# EAGLE design piezopiano (EAGLE 9.6.2)
CHECKED_BY: -; DRAWN_BY: Andreas Zapfl; REV: 1.4; TITLE: PiezoPiano
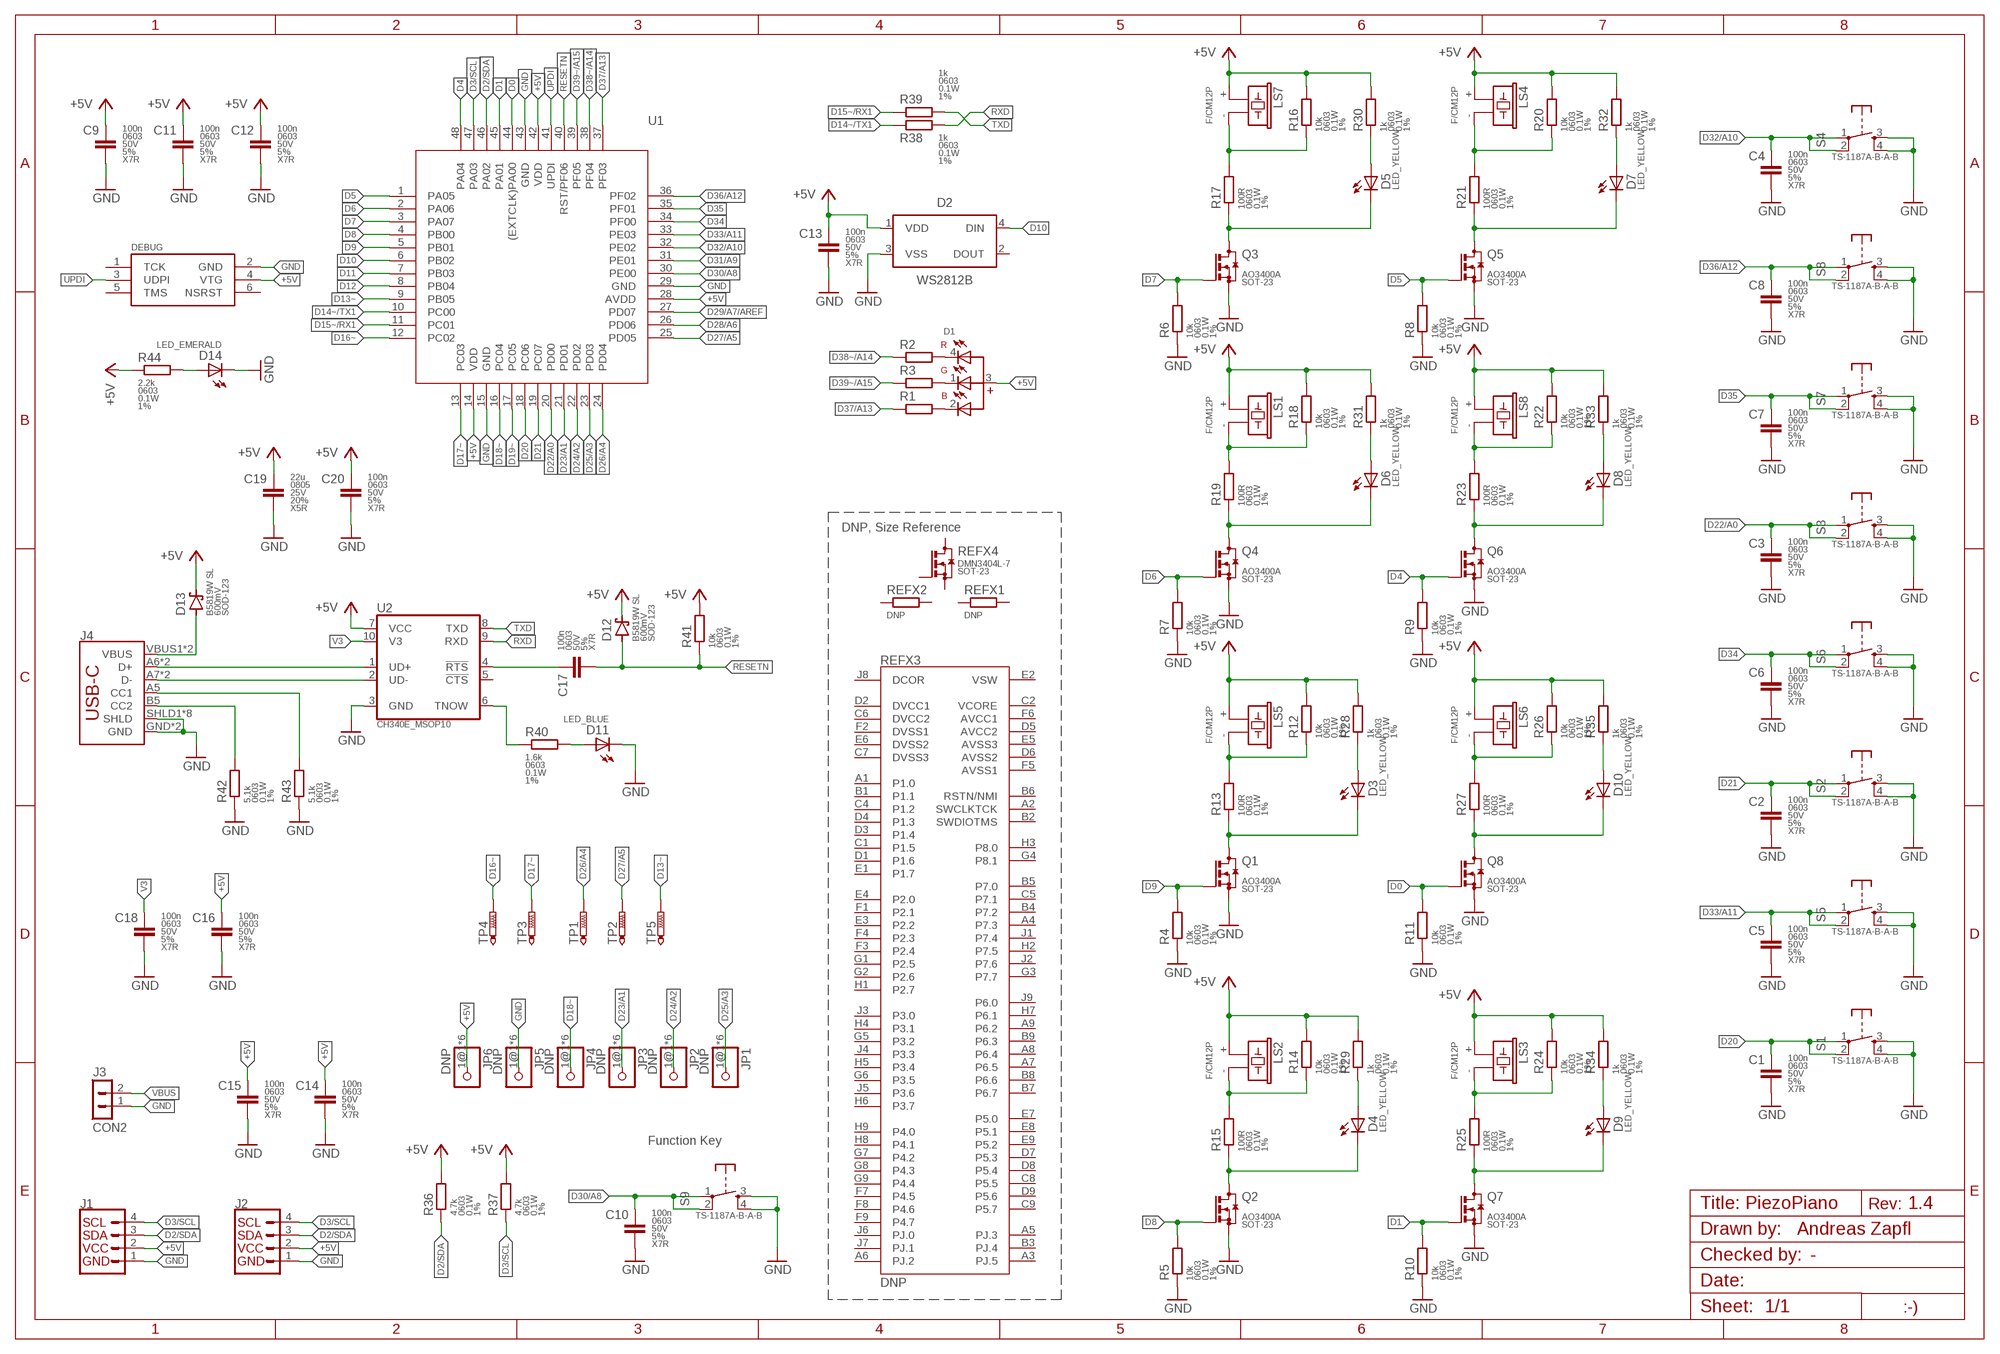
[diagram p0: schematic, sheet 1]

## Parts
C1  100n  100NF-0603-50V-5%  [C0603]
C2  100n  100NF-0603-50V-5%  [C0603]
C3  100n  100NF-0603-50V-5%  [C0603]
C4  100n  100NF-0603-50V-5%  [C0603]
C5  100n  100NF-0603-50V-5%  [C0603]
C6  100n  100NF-0603-50V-5%  [C0603]
C7  100n  100NF-0603-50V-5%  [C0603]
C8  100n  100NF-0603-50V-5%  [C0603]
C9  100n  100NF-0603-50V-5%  [C0603]
C10  100n  100NF-0603-50V-5%  [C0603]
C11  100n  100NF-0603-50V-5%  [C0603]
C12  100n  100NF-0603-50V-5%  [C0603]
C13  100n  100NF-0603-50V-5%  [C0603]
C14  100n  100NF-0603-50V-5%  [C0603]
C15  100n  100NF-0603-50V-5%  [C0603]
C16  100n  100NF-0603-50V-5%  [C0603]
C17  100n  100NF-0603-50V-5%  [C0603]
C18  100n  100NF-0603-50V-5%  [C0603]
C19  22u  22UF-0805-25V-20%  [C0805]
C20  100n  100NF-0603-50V-5%  [C0603]
D1  E6C1209RGBC3UDAM173000  [WL-SFCX_1210]
D2  WS2812B  [WS2812B]
D3  LED_YELLOW  CHIP-FLAT-Y_0603-0.55MM  [LEDC1608X55N_FLAT]
D4  LED_YELLOW  CHIP-FLAT-Y_0603-0.55MM  [LEDC1608X55N_FLAT]
D5  LED_YELLOW  CHIP-FLAT-Y_0603-0.55MM  [LEDC1608X55N_FLAT]
D6  LED_YELLOW  CHIP-FLAT-Y_0603-0.55MM  [LEDC1608X55N_FLAT]
D7  LED_YELLOW  CHIP-FLAT-Y_0603-0.55MM  [LEDC1608X55N_FLAT]
D8  LED_YELLOW  CHIP-FLAT-Y_0603-0.55MM  [LEDC1608X55N_FLAT]
D9  LED_YELLOW  CHIP-FLAT-Y_0603-0.55MM  [LEDC1608X55N_FLAT]
D10  LED_YELLOW  CHIP-FLAT-Y_0603-0.55MM  [LEDC1608X55N_FLAT]
D11  LED_BLUE  CHIP-FLAT-B_0603-0.55MM  [LEDC1608X55N_FLAT]
D12  B5819WSL  [SOD123]
D13  B5819WSL  [SOD123]
D14  LED_EMERALD  CHIP-FLAT-G_0603-0.55MM  [LEDC1608X55N_FLAT]
DEBUG  DNP  AVR-UPDI-6-SKEDD  [490107670612_DEBUGGING]
J1  QWIIC_CONNECTORJS-1MM  [1X04_1MM_RA]
J2  QWIIC_CONNECTORJS-1MM  [1X04_1MM_RA]
J3  CON2  [H2-2.54]
J4  USB_C2-LAYER  [USB-C-16P]
JP1  DNP  PINROW-1X5  [1X01]
JP2  DNP  PINROW-1X5  [1X01]
JP3  DNP  PINROW-1X5  [1X01]
JP4  DNP  PINROW-1X5  [1X01]
JP5  DNP  PINROW-1X5  [1X01]
JP6  DNP  PINROW-1X5  [1X01]
LS1  F/CM12P  [CM12P/5.0P]
LS2  F/CM12P  [CM12P/5.0P]
LS3  F/CM12P  [CM12P/5.0P]
LS4  F/CM12P  [CM12P/5.0P]
LS5  F/CM12P  [CM12P/5.0P]
LS6  F/CM12P  [CM12P/5.0P]
LS7  F/CM12P  [CM12P/5.0P]
LS8  F/CM12P  [CM12P/5.0P]
Q1  AO3400A  [SOT23]
Q2  AO3400A  [SOT23]
Q3  AO3400A  [SOT23]
Q4  AO3400A  [SOT23]
Q5  AO3400A  [SOT23]
Q6  AO3400A  [SOT23]
Q7  AO3400A  [SOT23]
Q8  AO3400A  [SOT23]
R1  1.6k  1.6KOHM-0603-1/10W-1%  [R0603]
R2  1k  1KOHM-0603-1/10W-1%  [R0603]
R3  2.2k  2.2KOHM-0603-1/10W-1%  [R0603]
R4  10k  10KOHM-0603-1/10W-1%  [R0603]
R5  10k  10KOHM-0603-1/10W-1%  [R0603]
R6  10k  10KOHM-0603-1/10W-1%  [R0603]
R7  10k  10KOHM-0603-1/10W-1%  [R0603]
R8  10k  10KOHM-0603-1/10W-1%  [R0603]
R9  10k  10KOHM-0603-1/10W-1%  [R0603]
R10  10k  10KOHM-0603-1/10W-1%  [R0603]
R11  10k  10KOHM-0603-1/10W-1%  [R0603]
R12  10k  10KOHM-0603-1/10W-1%  [R0603]
R13  100R  100OHM-0603-1/10W-1%  [R0603]
R14  10k  10KOHM-0603-1/10W-1%  [R0603]
R15  100R  100OHM-0603-1/10W-1%  [R0603]
R16  10k  10KOHM-0603-1/10W-1%  [R0603]
R17  100R  100OHM-0603-1/10W-1%  [R0603]
R18  10k  10KOHM-0603-1/10W-1%  [R0603]
R19  100R  100OHM-0603-1/10W-1%  [R0603]
R20  10k  10KOHM-0603-1/10W-1%  [R0603]
R21  100R  100OHM-0603-1/10W-1%  [R0603]
R22  10k  10KOHM-0603-1/10W-1%  [R0603]
R23  100R  100OHM-0603-1/10W-1%  [R0603]
R24  10k  10KOHM-0603-1/10W-1%  [R0603]
R25  100R  100OHM-0603-1/10W-1%  [R0603]
R26  10k  10KOHM-0603-1/10W-1%  [R0603]
R27  100R  100OHM-0603-1/10W-1%  [R0603]
R28  1k  1KOHM-0603-1/10W-1%  [R0603]
R29  1k  1KOHM-0603-1/10W-1%  [R0603]
R30  1k  1KOHM-0603-1/10W-1%  [R0603]
R31  1k  1KOHM-0603-1/10W-1%  [R0603]
R32  1k  1KOHM-0603-1/10W-1%  [R0603]
R33  1k  1KOHM-0603-1/10W-1%  [R0603]
R34  1k  1KOHM-0603-1/10W-1%  [R0603]
R35  1k  1KOHM-0603-1/10W-1%  [R0603]
R36  4.7k  4.7KOHM-0603-1/10W-1%  [R0603]
R37  4.7k  4.7KOHM-0603-1/10W-1%  [R0603]
R38  1k  1KOHM-0603-1/10W-1%  [R0603]
R39  1k  1KOHM-0603-1/10W-1%  [R0603]
R40  1.6k  1.6KOHM-0603-1/10W-1%  [R0603]
R41  10k  10KOHM-0603-1/10W-1%  [R0603]
R42  5.1k  5.1KOHM-0603-1/10W-1%  [R0603]
R43  5.1k  5.1KOHM-0603-1/10W-1%  [R0603]
R44  2.2k  2.2KOHM-0603-1/10W-1%  [R0603]
REFX1  DNP  DNP-0603  [R0603]
REFX2  DNP  DNP-0805  [R0805]
REFX3  DNP  MSP432P401RIZXHR  [BGA80]
REFX4  DNP  DMN3404L  [SOT23]
S1  TS-1187A-B-A-B  [TACTILE_SWITCH_SMD_5.2MM]
S2  TS-1187A-B-A-B  [TACTILE_SWITCH_SMD_5.2MM]
S3  TS-1187A-B-A-B  [TACTILE_SWITCH_SMD_5.2MM]
S4  TS-1187A-B-A-B  [TACTILE_SWITCH_SMD_5.2MM]
S5  TS-1187A-B-A-B  [TACTILE_SWITCH_SMD_5.2MM]
S6  TS-1187A-B-A-B  [TACTILE_SWITCH_SMD_5.2MM]
S7  TS-1187A-B-A-B  [TACTILE_SWITCH_SMD_5.2MM]
S8  TS-1187A-B-A-B  [TACTILE_SWITCH_SMD_5.2MM]
S9  TS-1187A-B-A-B  [TACTILE_SWITCH_SMD_5.2MM]
TP1  PTR1B1,27  [B1,27]
TP2  PTR1B1,27  [B1,27]
TP3  PTR1B1,27  [B1,27]
TP4  PTR1B1,27  [B1,27]
TP5  PTR1B1,27  [B1,27]
U1  ATMEGA4809  [TQFP48]
U2  CH340E_MSOP10  [MSOP10]

## Nets
+5V: C9.1 C11.1 C12.1 C13.1 C14.1 C15.1 C16.1 C19.1 C20.1 D1.3 D2.1(VDD) D12.C D13.C DEBUG.4(VTG) J1.2(VCC) J2.2(VCC) JP6.1@1 JP6.1@2 JP6.1@3 JP6.1@4 JP6.1@5 JP6.1@6 LS1.+ LS2.+ LS3.+ LS4.+ LS5.+ LS6.+ LS7.+ LS8.+ R12.2 R14.2 R16.2 R18.2 R20.2 R22.2 R24.2 R26.2 R28.2 R29.2 R30.2 R31.2 R32.2 R33.2 R34.2 R35.2 R36.2 R37.2 R41.2 R44.1 U1.14(VDD) U1.28(AVDD) U1.42(VDD) U2.7(VCC)
D0: Q8.1(G) R11.2 U1.44((EXTCLK)PA00)
D1: Q7.1(G) R10.2 U1.45(PA01)
D2/SDA: J1.3(SDA) J2.3(SDA) R36.1 U1.46(PA02)
D3/SCL: J1.4(SCL) J2.4(SCL) R37.1 U1.47(PA03)
D4: Q6.1(G) R9.2 U1.48(PA04)
D5: Q5.1(G) R8.2 U1.1(PA05)
D6: Q4.1(G) R7.2 U1.2(PA06)
D7: Q3.1(G) R6.2 U1.3(PA07)
D8: Q2.1(G) R5.2 U1.4(PB00)
D9: Q1.1(G) R4.2 U1.5(PB01)
D10: D2.4(DIN) U1.6(PB02)
D11: U1.7(PB03)
D12: U1.8(PB04)
D13~: TP5.TP U1.9(PB05)
D14~/TX1: R38.1 U1.10(PC00)
D15~/RX1: R39.1 U1.11(PC01)
D16~: TP4.TP U1.12(PC02)
D17~: TP3.TP U1.13(PC03)
D18~: JP4.1@1 JP4.1@2 JP4.1@3 JP4.1@4 JP4.1@5 JP4.1@6 U1.16(PC04)
D19~: U1.17(PC05)
D20: C1.1 S1.1(P) S1.2(P) U1.18(PC06)
D21: C2.1 S2.1(P) S2.2(P) U1.19(PC07)
D22/A0: C3.1 S3.1(P) S3.2(P) U1.20(PD00)
D23/A1: JP3.1@1 JP3.1@2 JP3.1@3 JP3.1@4 JP3.1@5 JP3.1@6 U1.21(PD01)
D24/A2: JP2.1@1 JP2.1@2 JP2.1@3 JP2.1@4 JP2.1@5 JP2.1@6 U1.22(PD02)
D25/A3: JP1.1@1 JP1.1@2 JP1.1@3 JP1.1@4 JP1.1@5 JP1.1@6 U1.23(PD03)
D26/A4: TP1.TP U1.24(PD04)
D27/A5: TP2.TP U1.25(PD05)
D28/A6: U1.26(PD06)
D29/A7/AREF: U1.27(PD07)
D30/A8: C10.1 S9.1(P) S9.2(P) U1.30(PE00)
D31/A9: U1.31(PE01)
D32/A10: C4.1 S4.1(P) S4.2(P) U1.32(PE02)
D33/A11: C5.1 S5.1(P) S5.2(P) U1.33(PE03)
D34: C6.1 S6.1(P) S6.2(P) U1.34(PF00)
D35: C7.1 S7.1(P) S7.2(P) U1.35(PF01)
D36/A12: C8.1 S8.1(P) S8.2(P) U1.36(PF02)
D37/A13: R1.1 U1.37(PF03)
D38~/A14: R2.1 U1.38(PF04)
D39~/A15: R3.1 U1.39(PF05)
GND: C1.2 C2.2 C3.2 C4.2 C5.2 C6.2 C7.2 C8.2 C9.2 C10.2 C11.2 C12.2 C13.2 C14.2 C15.2 C16.2 C18.2 C19.2 C20.2 D2.3(VSS) D11.C D14.C DEBUG.2(GND) J1.1(GND) J2.1(GND) J3.1 J4.GND J4.GND2(GND) J4.SHLD1(SHLD) J4.SHLD2(SHLD) J4.SHLD3(SHLD) J4.SHLD4(SHLD) J4.SHLD5(SHLD) J4.SHLD6(SHLD) J4.SHLD7(SHLD) J4.SHLD8(SHLD) JP5.1@1 JP5.1@2 JP5.1@3 JP5.1@4 JP5.1@5 JP5.1@6 Q1.2(S) Q2.2(S) Q3.2(S) Q4.2(S) Q5.2(S) Q6.2(S) Q7.2(S) Q8.2(S) R4.1 R5.1 R6.1 R7.1 R8.1 R9.1 R10.1 R11.1 R42.1 R43.1 S1.3(S) S1.4(S) S2.3(S) S2.4(S) S3.3(S) S3.4(S) S4.3(S) S4.4(S) S5.3(S) S5.4(S) S6.3(S) S6.4(S) S7.3(S) S7.4(S) S8.3(S) S8.4(S) S9.3(S) S9.4(S) U1.15(GND) U1.29(GND) U1.43(GND) U2.3(GND)
N$1: C17.1 U2.4(!RTS)
N$2: D6.C Q4.3(D) R19.1
N$3: D3.C Q1.3(D) R13.1
N$4: LS2.- R14.1 R15.2
N$5: D7.C Q5.3(D) R21.1
N$6: LS8.- R22.1 R23.2
N$7: D10.C Q8.3(D) R27.1
N$8: D14.A R44.2
N$9: D5.C Q3.3(D) R17.1
N$10: LS1.- R18.1 R19.2
N$11: LS5.- R12.1 R13.2
N$12: D4.C Q2.3(D) R15.1
N$13: LS4.- R20.1 R21.2
N$14: D8.C Q6.3(D) R23.1
N$15: LS6.- R26.1 R27.2
N$16: LS3.- R24.1 R25.2
N$17: D9.C Q7.3(D) R25.1
N$18: LS7.- R16.1 R17.2
N$19: R40.1 U2.6(TNOW)
N$20: D11.A R40.2
N$21: D1.4(R) R2.2
N$22: D5.A R30.1
N$23: D7.A R32.1
N$24: D8.A R33.1
N$25: D6.A R31.1
N$26: D10.A R35.1
N$27: D3.A R28.1
N$28: D1.2(B) R1.2
N$29: J4.B5(CC2) R42.2
N$30: J4.A5(CC1) R43.2
N$31: J4.A6(D+) J4.B6(D+) U2.1(UD+)
N$32: J4.A7(D-) J4.B7(D-) U2.2(UD-)
N$33: D4.A R29.1
N$34: D9.A R34.1
N$35: D1.1(G) R3.2
RESETN: C17.2 D12.A R41.1 U1.40(RST/PF06)
RXD: R38.2 U2.9(RXD)
TXD: R39.2 U2.8(TXD)
UPDI: DEBUG.3(UDPI) U1.41(UPDI)
V3: C18.1 U2.10(V3)
VBUS: D13.A J3.2 J4.VBUS1(VBUS) J4.VBUS2(VBUS)
Unconnected: D2.2(DOUT) DEBUG.1(TCK) DEBUG.5(TMS) DEBUG.6(NSRST) REFX1.1 REFX1.2 REFX2.1 REFX2.2 REFX3.A1(P1.0) REFX3.A2(SWCLKTCK) REFX3.A3(PJ.5) REFX3.A4(P7.3) REFX3.A5(PJ.3) REFX3.A6(PJ.2) REFX3.A7(P6.5) REFX3.A8(P6.4) REFX3.A9(P6.2) REFX3.B1(P1.1) REFX3.B2(SWDIOTMS) REFX3.B3(PJ.4) REFX3.B4(P7.2) REFX3.B5(P7.0) REFX3.B6(RSTN/NMI) REFX3.B7(P6.7) REFX3.B8(P6.6) REFX3.B9(P6.3) REFX3.C1(P1.5) REFX3.C4(P1.2) REFX3.C5(P7.1) REFX3.C8(P5.5) REFX3.C9(P5.7) REFX3.D1(P1.6) REFX3.D3(P1.4) REFX3.D4(P1.3) REFX3.D7(P5.3) REFX3.D8(P5.4) REFX3.D9(P5.6) REFX3.E1(P1.7) REFX3.E3(P2.2) REFX3.E4(P2.0) REFX3.E7(P5.0) REFX3.E8(P5.1) REFX3.E9(P5.2) REFX3.F1(P2.1) REFX3.F3(P2.4) REFX3.F4(P2.3) REFX3.F7(P4.5) REFX3.F8(P4.6) REFX3.F9(P4.7) REFX3.G1(P2.5) REFX3.G2(P2.6) REFX3.G3(P7.7) REFX3.G4(P8.1) REFX3.G5(P3.2) REFX3.G6(P3.5) REFX3.G7(P4.2) REFX3.G8(P4.3) REFX3.G9(P4.4) REFX3.H1(P2.7) REFX3.H2(P7.5) REFX3.H3(P8.0) REFX3.H4(P3.1) REFX3.H5(P3.4) REFX3.H6(P3.7) REFX3.H7(P6.1) REFX3.H8(P4.1) REFX3.H9(P4.0) REFX3.J1(P7.4) REFX3.J2(P7.6) REFX3.J3(P3.0) REFX3.J4(P3.3) REFX3.J5(P3.6) REFX3.J6(PJ.0) REFX3.J7(PJ.1) REFX3.J9(P6.0) REFX4.1(G) REFX4.2(S) REFX4.3(D) U2.5(!CTS)

## Notes on the sheet
- DNP, Size Reference
- Function Key

## Power pins joined to a net without a drawn wire
AVCC1: REFX3.F6(AVCC1)
AVCC2: REFX3.D5(AVCC2)
AVSS1: REFX3.F5(AVSS1)
AVSS2: REFX3.D6(AVSS2)
AVSS3: REFX3.E5(AVSS3)
DCOR: REFX3.J8(DCOR)
DVCC1: REFX3.D2(DVCC1)
DVCC2: REFX3.C6(DVCC2)
DVSS1: REFX3.F2(DVSS1)
DVSS2: REFX3.E6(DVSS2)
DVSS3: REFX3.C7(DVSS3)
VCORE: REFX3.C2(VCORE)
VSW: REFX3.E2(VSW)

## Library data of the parts
C1-C18 C20 = zaan-Capacitors:100NF: 100nF capacitor; DESCRIPTION: Chip Capacitor; DIELECTRIC: X7R; MF: Yageo; MPN: CC0603JRX7R9BB104; PACKAGE: 1606; PACKAGE-IN: 0603; TOLERANCE: 5%; VOLTAGE: 50V
C19 = zaan-Capacitors:22UF: 22uF capacitor; DESCRIPTION: Chip Capacitor; DIELECTRIC: X5R; MF: Murata; MPN: GRM21BR61E226ME44L; PACKAGE: 2012; PACKAGE-IN: 0805; TOLERANCE: 20%; VOLTAGE: 25V
D1 = zaan-Optoelectronics:E6C1209RGBC3UDA: WL-SFCW SMD Full-color Chip LED Waterclear Details see: DATASHEET <https://datasheet.lcsc.com/lcsc/2203301730_EKINGLUX-E6C1209RGBC3UDA_C375572.pdf>; DESCRIPTION: RGB SMD LED; LCSC: C375572; MF: EKINGLUX; MPN: E6C1209RGBC3UDA; PACKAGE: 1210
D2 = zaan-Optoelectronics:WS2812B: Intelligent control LED integrated light source Datasheet <http://cdn.sparkfun.com/datasheets/BreakoutBoards/WS2812B.pdf>; CATEGORY: LED; COLOR: RGB; DESCRIPTION: WS2812 RGB LED; LCSC: C2761795; MANUFACTURER: Worldsemi; MPN: WS2812B-B/W; OPERATING_TEMP: -25 ℃ to +80℃(TJ); PART_STATUS: Active; SUB_CATEGORY: RGB
D3-D10 = zaan-Optoelectronics:CHIP-FLAT-Y; CATEGORY: LED; COLOR: YELLOW; DESCRIPTION: CHIP LED FLAT; LCSC: C72038; MANUFACTURER: Everlight Elec; MPN: 19-213/Y2C-CQ2R2L/3T(CY); SUB-CATEGORY: CHIP; TYPE: FLAT_TOP
D11 = zaan-Optoelectronics:CHIP-FLAT-B; CATEGORY: LED; COLOR: BLUE; DESCRIPTION: CHIP LED FLAT; LCSC: C72043; MANUFACTURER: Everlight Elec; MPN: 19-217/GHC-YR1S2/3T; SUB-CATEGORY: CHIP; TYPE: FLAT_TOP
D12 D13 = zaan-Discrete:B5819WSL: Schottky Diode 40 V, 1 A Schottky barrier diodes Footprint: SOT-123 Source: Datasheet <https://datasheet.lcsc.com/lcsc/1809140216_Changjiang-Electronics-Tech--CJ-B5819W-SL_C8598.pdf> Manufacturer: Changjiang Electronics Tech (CJ); DESCRIPTION: Schottky Diode; LCSC: C8598; MF: Changjiang Electronics Tech (CJ); MPN: B5819W SL; PACKAGE: SOD-123; VOLTAGE_FORWARD: 600mV
D14 = zaan-Optoelectronics:CHIP-FLAT-G; CATEGORY: LED; COLOR: EMERALD; DESCRIPTION: CHIP LED FLAT; LCSC: C72041; MANUFACTURER: Everlight Elec; MPN: 19-217/BHC-ZL1M2RY/3T; SUB-CATEGORY: CHIP; TYPE: FLAT_TOP
DEBUG = zaan-Connectors:AVR-UPDI-6
J1 J2 = zaan-Connectors:QWIIC_CONNECTOR: SMD Header 1MM 4Pin; DESCRIPTION: Header SMD 1MM 4Pin; LCSC: C145956; MF: BOOMELE; MPN: C145956
J3 = Custom:CON2
J4 = zaan-Connectors:USB_C: USB Type C 16 Pin Connector Female 16 Pin Connector Footprint: USB-C 16P Source: Datasheet <https://datasheet.lcsc.com/szlcsc/1811101520_Jing-Extension-of-the-Electronic-Co-C167321_C167321.pdf> Manufacturer: Jing Extension of the Electronic Co. Super Speed pins not available on the 16-pin purely SMD connector so this part is best for USB 2.0 implementations. D1 and D2 are tied together enabling D+/- no matter which way the cable is plugged into the connector. The two channel configuration pins (CC1/2) are exposed. These are normally connected to ground via 5.1k resistors but can be reconfigured for high current/high power applications.; DESCRIPTION: USB Type C Female; LCSC: C2927300; MF: YIYUAN; MPN: YTC-TC16S-23; PACKAGE: USB-C 16P
JP1-JP6 = zaan-No-Category:PINROW-1X5: PIN HEADER; CATEGORY: CONNECTOR; SUB-CATEGORY: PIN-HEADER
LS1-LS8 = zaan-Electromechanical:F/CM12P: BUZZER; DESCRIPTION: Piezo Buzzer; LCSC: C219727; MF: ZLFY; MPN: ZL-YDW1207-4005PA-5.0
Q1-Q8 = zaan-Discrete:AO3400A: N-CHANNEL MOS FET N-Channel Logic Level Enhancement Mode Field Effect Transistor Footprint: SOT-23 Source: Datasheet <https://www.diodes.com/assets/Datasheets/ds31787.pdf> Manufacturer: Diodes Incorporated; DESCRIPTION: N-CHANNEL MOSFET; LCSC: C20917; MF: Alpha & Omega Semicon; MPN: AO3400A; PACKAGE: SOT-23
R1 R40 = zaan-Resistors:1.6KOHM: 1.6kΩ resistor; DESCRIPTION: Chip Resistor; MF: Yageo; MPN: RC0603FR-071K6L; PACKAGE: 1608; PACKAGE-IN: 0603; POWER: 0.1W; TOLERANCE: 1%; VOLTAGE: 75V
R2 R28-R35 R38 R39 = zaan-Resistors:1KOHM: 1kΩ resistor; DESCRIPTION: Chip Resistor; MF: Yageo; MPN: RC0603FR-071KL; PACKAGE: 1608; PACKAGE-IN: 0603; POWER: 0.1W; TOLERANCE: 1%; VOLTAGE: 75V
R3 R44 = zaan-Resistors:2.2KOHM: 2.2kΩ resistor; DESCRIPTION: Chip Resistor; MF: Yageo; MPN: RC0603FR-072K2L; PACKAGE: 1608; PACKAGE-IN: 0603; POWER: 0.1W; TOLERANCE: 1%; VOLTAGE: 75V
R4-R12 R14 R16 R18 R20 R22 R24 R26 R41 = zaan-Resistors:10KOHM: 10kΩ resistor; DESCRIPTION: Chip Resistor; MF: Yageo; MPN: RC0603FR-0710KL; PACKAGE: 1608; PACKAGE-IN: 0603; POWER: 0.1W; TOLERANCE: 1%; VOLTAGE: 75V
R13 R15 R17 R19 R21 R23 R25 R27 = zaan-Resistors:100OHM: 100Ω resistor; DESCRIPTION: Chip Resistor; MF: Yageo; MPN: RC0603FR-07100RL; PACKAGE: 1608; PACKAGE-IN: 0603; POWER: 0.1W; TOLERANCE: 1%; VOLTAGE: 75V
R36 R37 = zaan-Resistors:4.7KOHM: 4.7kΩ resistor; DESCRIPTION: Chip Resistor; MF: Yageo; MPN: RC0603FR-074K7L; PACKAGE: 1608; PACKAGE-IN: 0603; POWER: 0.1W; TOLERANCE: 1%; VOLTAGE: 75V
R42 R43 = zaan-Resistors:5.1KOHM: 5.1kΩ resistor; DESCRIPTION: Chip Resistor; MF: Yageo; MPN: RC0603FR-075K1L; PACKAGE: 1608; PACKAGE-IN: 0603; POWER: 0.1W; TOLERANCE: 1%; VOLTAGE: 75V
REFX1 REFX2 = zaan-Resistors:DNP; DESCRIPTION: Chip Resistor
REFX3 = zaan-IC-Microcontroller:MSP432P401RIZXHR: IC MCU 32BIT 256KB FLASH 80NFBGA Manufacturer's datasheet <http://www.ti.com/lit/ds/symlink/msp432p401r.pdf>; CREATED_BY: PCBLayout.com; DIGIKEY_PARTNO: 296-45566-6-ND; MANUFACTURER: Texas Instruments; MPN: MSP432P401RIZXHR; PACKAGE: 80-NFBGA
REFX4 = zaan-Discrete:DMN3404L: N-CHANNEL MOS FET N-Channel Logic Level Enhancement Mode Field Effect Transistor Footprint: SOT-23 Source: Datasheet <https://www.diodes.com/assets/Datasheets/ds31787.pdf> Manufacturer: Diodes Incorporated; DESCRIPTION: N-CHANNEL MOSFET; MF: Diodes Incorporated; MPN: DMN3404L-7; PACKAGE: SOT-23
S1-S9 = zaan-Electromechanical:TS-1187A-B-A-B; DESCRIPTION: Tactile Button SMD; LCSC: C318884; MF: XKB Connectivity; MPN: TS-1187A-B-A-B
TP1-TP5 = testpad:PTR1: TEST PIN
U1 = zaan-IC-Microcontroller:ATMEGA4809: ATMEGA4809; DATASHEET: http://ww1.microchip.com/downloads/en/DeviceDoc/40002016A.pdf; DESCRIPTION: ATmega4809 Microcontroller; DISTRIBUTOR-LINK: https://www.digikey.com/product-detail/en/microchip-technology/ATMEGA4809-AFR/ATMEGA4809-AFRCT-ND/8540756; DISTRIBUTOR-PN: ATMEGA4809-AFRCT-ND; LCSC: C189475; MANUFACTURER: Microchip; MPN: ATMEGA4809-AFR
U2 = zaan-IC-General:CH340E: CH340E USB to serial chip Footprint: MSOP-10 Source: Datasheet <https://www.mpja.com/download/35227cpdata.pdf> Manufacturer: Jiangsu Qin Heng; DESCRIPTION: UART Converter; LCSC: C99652; MF: Jiangsu Qin Heng; MPN: CH340E; PACKAGE: MSOP-10

## Net classes
0 default: width 0.254 mm, drill 0.3 mm, clearance 0.004 mm

## Board
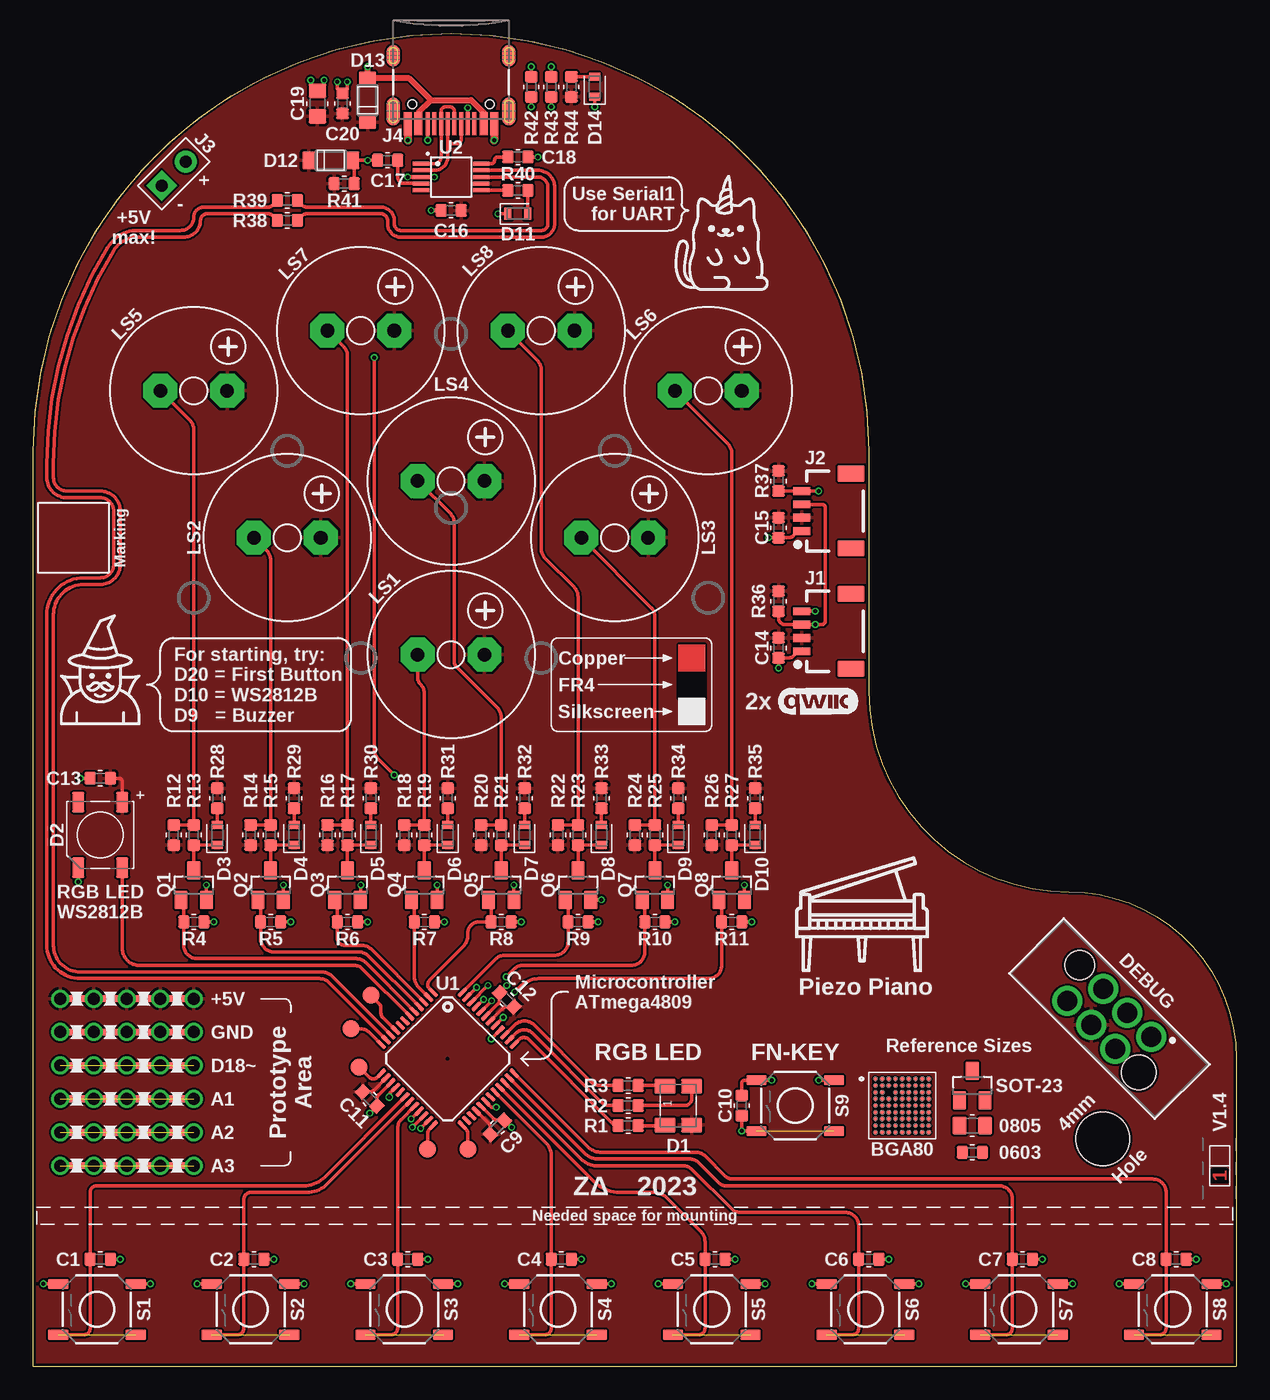
[diagram p1: board, top side]
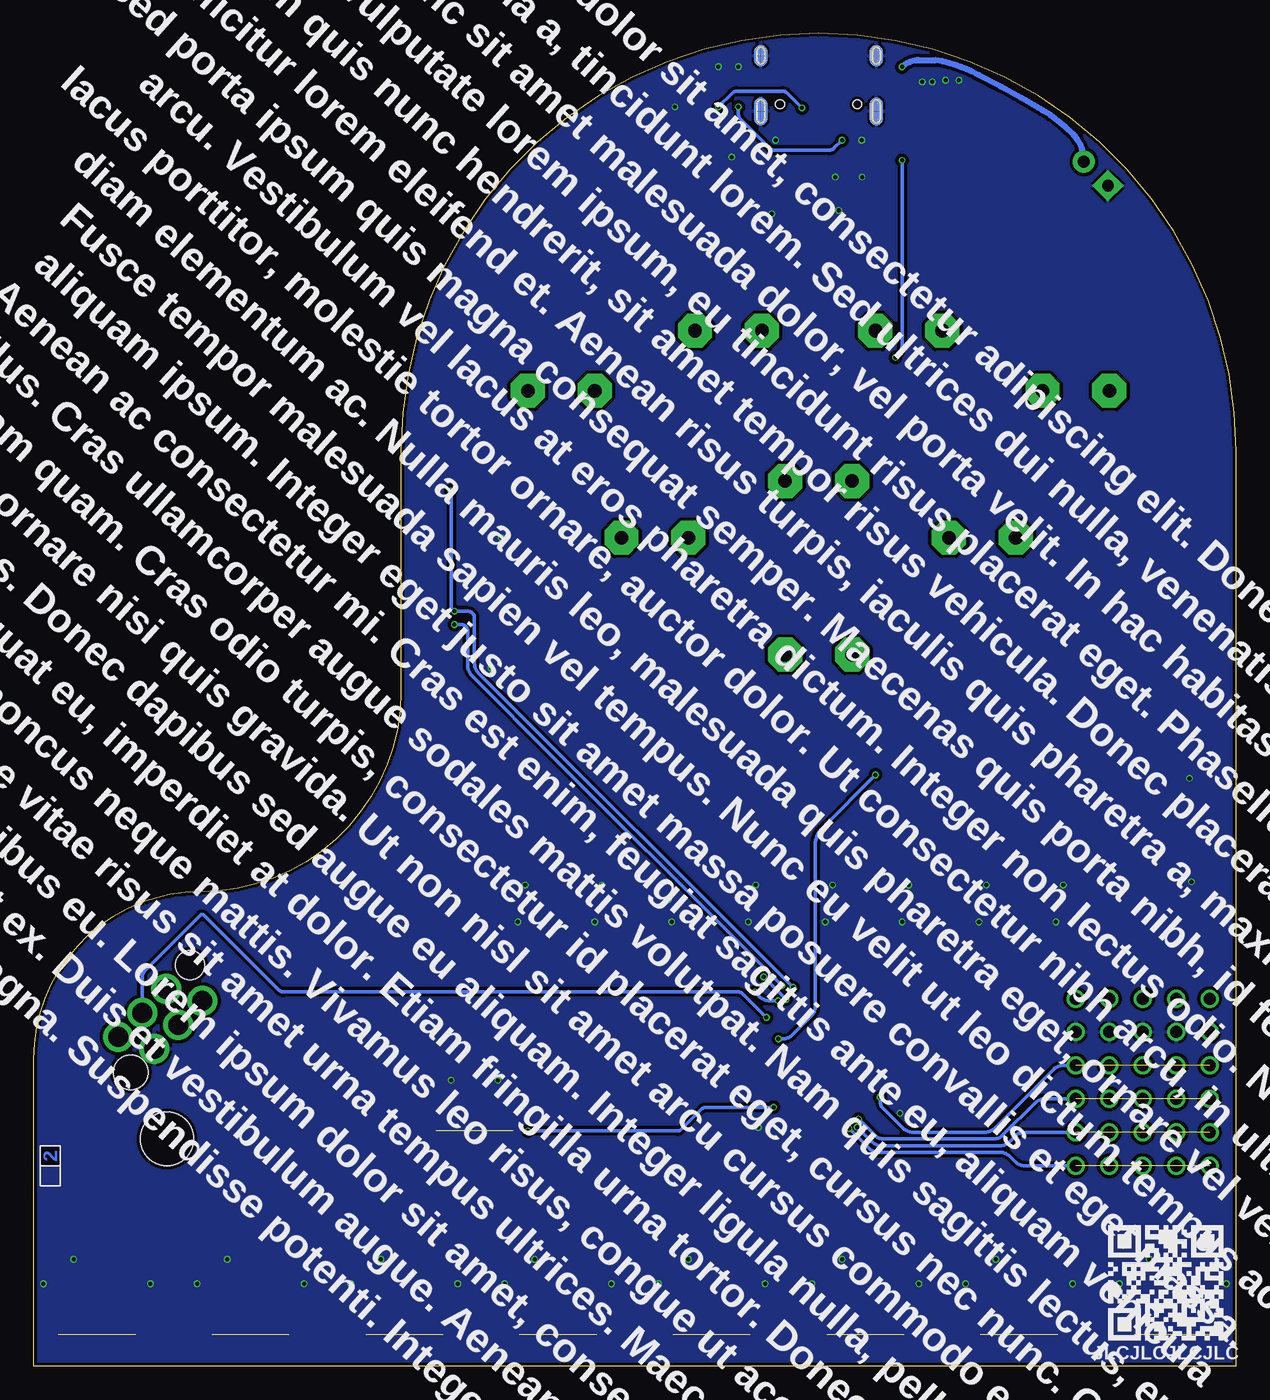
[diagram p2: board, bottom side, seen from below]

Size 90 x 99.75 mm. Coordinates in mm from the lower left corner, seen from the top.
Outline: 0,0 90,0 90,23 arc90 77.5,35.5 arc-90 62.5,50.5 62.5,68.5 arc90 31.25,99.75 arc90 0,68.5 0,0
Copper layers (1*16): Top 0.035mm / dielectric 1.55mm / Bottom 0.035mm
Design rules "Multi-CB_2L_EET": minimum track width 0.1mm, minimum drill 0.2mm, track to track 0.1mm, track to pad 0.1mm, pad to pad 0.1mm, via to via 0.1mm, smd to smd 0mil, copper to edge 0.2mm, drill to drill 0.2mm, minimum pad ring 0.125mm, minimum via ring 0.1mm, stop-mask expansion 2mil, vias tented up to drill 0.45mm, thermal gap 0.2mm
Holes 4 mm at 80,17
tKeepout: area 0,10.1 to 90,12.4

### Footprints (pad centres in the part's own frame; a part is rotated, then mirrored left to right if it is on the bottom)
C0603 = smd 0.85 x 0.95: 1 -0.75,0; 2 0.75,0
C0805 = smd 1.1 x 1.35: 1 -0.95,0; 2 0.95,0
WL-SFCX_1210 = smd 1.1 x 1.6: 1 -1.45,-1; 2 1.45,-1; 3 1.45,1; 4 -1.45,1
WS2812B = smd 1.5 x 0.9: 1 -2.45,1.65; 2 -2.45,-1.65; 3 2.45,-1.65; 4 2.45,1.65
LEDC1608X55N_FLAT = smd 0.612 x 0.912: A 0.75,0; C -0.75,0
SOD123 = smd 1 x 1.3: A 1.635,0; C -1.635,0
490107670612_DEBUGGING = drill 1.5 pad 1.825: 1 3.175,1.27; 2 1.905,-1.27; 3 0.635,1.27; 4 -0.635,-1.27; 5 -1.905,1.27; 6 -3.175,-1.27 | hole 2.2: -4.405,1.27 | hole 2.6: 4.405,-1.27
1X04_1MM_RA = smd 0.6 x 1.35: 1 -1.5,0; 2 -0.5,0; 3 0.5,0; 4 1.5,0 | smd 1.2 x 2: NC1 2.8,-3.675; NC2 -2.8,-3.675
H2-2.54 = drill 0.889 pad 1.651 square: 1 0,1.27 | drill 0.889 pad 1.651: 2 0,-1.27
USB-C-16P = smd 0.3 x 1.7: A5 -1.25,4.01; A6 -0.25,4.01; A7 0.25,4.01; A8 1.25,4.01; B5 1.75,4.01; B6 0.75,4.01; B7 -0.75,4.01; B8 -1.75,4.01 | smd 0.6 x 1.7: GND -3.225,4.01; GND2 3.225,4.01; VBUS1 -2.45,4.01; VBUS2 2.45,4.01 | smd 1 x 2.1: SHLD1 -4.32,3.085; SHLD2 4.32,3.085 | smd 1 x 2.1 bottom: SHLD3 -4.32,3.085; SHLD4 4.32,3.085 | smd 1 x 1.6: SHLD5 -4.32,-1.095; SHLD8 4.32,-1.095 | smd 1 x 1.6 bottom: SHLD6 -4.32,-1.095; SHLD7 4.32,-1.095 | hole 0.65: -2.89,2.555; 2.89,2.555
1X01 = drill 0.9: 1@1 -5,0; 1@2 -2.5,0; 1@3 0,0; 1@4 2.5,0; 1@5 5,0 | smd 10 x 0.5: 1@6 0,0
CM12P/5.0P = drill 1.016 pad 2.54 octagon: + 2.5,0; - -2.5,0
SOT23 = smd 1 x 1.4: 1 -0.95,-1.1; 2 0.95,-1.1; 3 0,1.1
R0603 = smd 0.85 x 0.95: 1 -0.75,0; 2 0.75,0
R0805 = smd 1.1 x 1.35: 1 -0.95,0; 2 0.95,0
BGA80 = smd 0.25 x 0.25: A1 -2,2; A2 -2,1.5; A3 -2,1; A4 -2,0.5; A5 -2,0; A6 -2,-0.5; A7 -2,-1; A8 -2,-1.5; A9 -2,-2; B1 -1.5,2; B2 -1.5,1.5; B3 -1.5,1; B4 -1.5,0.5; B5 -1.5,0; B6 -1.5,-0.5; B7 -1.5,-1; B8 -1.5,-1.5; B9 -1.5,-2; C1 -1,2; C2 -1,1.5; C4 -1,0.5; C5 -1,0; C6 -1,-0.5; C7 -1,-1; C8 -1,-1.5; C9 -1,-2; D1 -0.5,2; D2 -0.5,1.5; D3 -0.5,1; D4 -0.5,0.5; D5 -0.5,0; D6 -0.5,-0.5; D7 -0.5,-1; D8 -0.5,-1.5; D9 -0.5,-2; E1 0,2; E2 0,1.5; E3 0,1; E4 0,0.5; E5 0,0; E6 0,-0.5; E7 0,-1; E8 0,-1.5; E9 0,-2; F1 0.5,2; F2 0.5,1.5; F3 0.5,1; F4 0.5,0.5; F5 0.5,0; F6 0.5,-0.5; F7 0.5,-1; F8 0.5,-1.5; F9 0.5,-2; G1 1,2; G2 1,1.5; G3 1,1; G4 1,0.5; G5 1,0; G6 1,-0.5; G7 1,-1; G8 1,-1.5; G9 1,-2; H1 1.5,2; H2 1.5,1.5; H3 1.5,1; H4 1.5,0.5; H5 1.5,0; H6 1.5,-0.5; H7 1.5,-1; H8 1.5,-1.5; H9 1.5,-2; J1 2,2; J2 2,1.5; J3 2,1; J4 2,0.5; J5 2,0; J6 2,-0.5; J7 2,-1; J8 2,-1.5; J9 2,-2
TACTILE_SWITCH_SMD_5.2MM = smd 1.524 x 0.762: 1 -2.9,1.905; 2 2.9,1.905; 3 -2.9,-1.905; 4 2.9,-1.905
B1,27 = smd 1.27 x 1.27: TP 0,0
TQFP48 = smd 0.85 x 0.32: 1 -4.275,2.75; 2 -4.275,2.25; 3 -4.275,1.75; 4 -4.275,1.25; 5 -4.275,0.75; 6 -4.275,0.25; 7 -4.275,-0.25; 8 -4.275,-0.75; 9 -4.275,-1.25; 10 -4.275,-1.75; 11 -4.275,-2.25; 12 -4.275,-2.75; 25 4.275,-2.75; 26 4.275,-2.25; 27 4.275,-1.75; 28 4.275,-1.25; 29 4.275,-0.75; 30 4.275,-0.25; 31 4.275,0.25; 32 4.275,0.75; 33 4.275,1.25; 34 4.275,1.75; 35 4.275,2.25; 36 4.275,2.75 | smd 0.32 x 0.85: 13 -2.75,-4.275; 14 -2.25,-4.275; 15 -1.75,-4.275; 16 -1.25,-4.275; 17 -0.75,-4.275; 18 -0.25,-4.275; 19 0.25,-4.275; 20 0.75,-4.275; 21 1.25,-4.275; 22 1.75,-4.275; 23 2.25,-4.275; 24 2.75,-4.275; 37 2.75,4.275; 38 2.25,4.275; 39 1.75,4.275; 40 1.25,4.275; 41 0.75,4.275; 42 0.25,4.275; 43 -0.25,4.275; 44 -0.75,4.275; 45 -1.25,4.275; 46 -1.75,4.275; 47 -2.25,4.275; 48 -2.75,4.275 | smd 0 x 0: EP 0,0
MSOP10 = smd 1.2 x 0.3: 1 -2.25,1; 2 -2.25,0.5; 3 -2.25,0; 4 -2.25,-0.5; 5 -2.25,-1; 6 2.25,-1; 7 2.25,-0.5; 8 2.25,0; 9 2.25,0.5; 10 2.25,1

### Placement (x,y rotation side)
C1  5,8 0 top
C2  16.5,8 0 top
C3  28,8 0 top
C4  39.5,8 0 top
C5  51,8 0 top
C6  62.5,8 0 top
C7  74,8 0 top
C8  85.5,8 0 top
C9  34.71,17.87 45 top
C10  53,19.5 90 top
C11  25.17,19.99 315 top
C12  35.42,27.42 135 top
C13  5,44 180 top
C14  55.75,53.75 270 top
C15  55.75,62.75 270 top
C16  31.25,86.5 180 top
C17  26.5,90.25 180 top
C18  36.25,90.5 0 top
C19  21.25,94.5 90 top
C20  23.12,94.5 90 top
D1  48.25,19.5 270 top
D2  5,39.75 270 top
D3  13.75,39.75 90 top
D4  19.5,39.75 90 top
D5  25.25,39.75 90 top
D6  31,39.75 90 top
D7  36.75,39.75 90 top
D8  42.5,39.75 90 top
D9  48.25,39.75 90 top
D10  54,39.75 90 top
D11  36.25,86.25 0 top
D12  22.25,90.25 0 top
D13  25,94.75 90 top
D14  42,95.75 90 top
DEBUG  80.5,26 315 top
J1  57.5,55 90 top
J2  57.5,64 90 top
J3  10.5,89.25 135 top
J4  31.25,97 180 top
JP1  7,15 180 top
JP2  7,17.5 180 top
JP3  7,20 180 top
JP4  7,22.5 180 top
JP5  7,25 180 top
JP6  7,27.5 180 top
LS1  31.25,53.25 0 top
LS2  19,62 0 top
LS3  43.5,62 0 top
LS4  31.25,66.25 0 top
LS5  12,73 0 top
LS6  50.5,73 0 top
LS7  24.5,77.5 0 top
LS8  38,77.5 0 top
Q1  12,36 0 top
Q2  17.75,36 0 top
Q3  23.5,36 0 top
Q4  29.25,36 0 top
Q5  35,36 0 top
Q6  40.75,36 0 top
Q7  46.5,36 0 top
Q8  52.25,36 0 top
R1  44.5,18 0 top
R2  44.5,19.5 0 top
R3  44.5,21 0 top
R4  12,33.25 180 top
R5  17.75,33.25 180 top
R6  23.5,33.25 180 top
R7  29.25,33.25 180 top
R8  35,33.25 180 top
R9  40.75,33.25 180 top
R10  46.5,33.25 180 top
R11  52.25,33.25 180 top
R12  10.5,39.75 270 top
R13  12,39.75 90 top
R14  16.25,39.75 270 top
R15  17.75,39.75 90 top
R16  22,39.75 270 top
R17  23.5,39.75 90 top
R18  27.75,39.75 270 top
R19  29.25,39.75 90 top
R20  33.5,39.75 270 top
R21  35,39.75 90 top
R22  39.25,39.75 270 top
R23  40.75,39.75 90 top
R24  45,39.75 270 top
R25  46.5,39.75 90 top
R26  50.75,39.75 270 top
R27  52.25,39.75 90 top
R28  13.75,42.5 90 top
R29  19.5,42.5 90 top
R30  25.25,42.5 90 top
R31  31,42.5 90 top
R32  36.75,42.5 90 top
R33  42.5,42.5 90 top
R34  48.25,42.5 90 top
R35  54,42.5 90 top
R36  55.75,57.25 90 top
R37  55.75,66.25 90 top
R38  19,85.75 0 top
R39  19,87.25 0 top
R40  36.25,88 0 top
R41  23.25,88.5 180 top
R42  37.25,95.75 270 top
R43  38.75,95.75 270 top
R44  40.25,95.75 90 top
REFX1  70.25,16 180 top
REFX2  70.25,18 180 top
REFX3  65,19.5 0 top
REFX4  70.25,21 0 top
S1  4.75,4.25 180 top
S2  16.25,4.25 180 top
S3  27.75,4.25 180 top
S4  39.25,4.25 180 top
S5  50.75,4.25 180 top
S6  62.25,4.25 180 top
S7  73.75,4.25 180 top
S8  85.25,4.25 180 top
S9  57,19.5 180 top
TP1  29.5,16.25 90 top
TP2  32.5,16.25 90 top
TP3  24.38,22.38 0 top
TP4  23.75,25.25 0 top
TP5  25.25,27.75 0 top
U1  31,23 315 top
U2  31.25,89 0 top
U$1  [STACKUP-2L]  88.75,15 90 top
U$2  [PIANO-10MM]  57,29.5 0 top
U$3  [WIZARD-6MM]  2,48 0 top
U$4  [QWIIC_6MM]  58.75,49.75 0 top
U$5  [EXPLANATION-2-2MM]  49.25,51 180 top
U$6  [QR-SPACE]  3,62 270 top
U$7  [CATICORN-7MM]  48,80.5 0 top
U$100  [GITHUB-JRZ-10]  10.25,1.25 0 bottom
U$101  [JLC_UID]  5.25,1 0 bottom

### Tracks (layer width: path | path; a pad name or v marks a point on that pad's centre or on a via)
+5V
  Top 0.254: C12.1 35.45,26.89 arc45 35.1,26.74 U1.42 | U1.28 34.04,18.2 arc-45 34.18,17.84 C9.1 | C11.1 25.14,20.52 arc45 25.49,20.67 U1.14 | C13.1 6.4,44 arc-90 6.65,43.75 D2.1
  pour Top (isolate 0.15, rank 3): 0,0 0,100 90,100 90,0
D0  (via drill 0.3)
  Top 0.254: U1.44 v34.28,27.34 | v36,28 36.41,28.41 arc-45 37.83,29 50.5,29 arc90 51.5,30 R11.2 51.5,34.7 Q8.1
  Bottom 0.254: v34.28,27.34 34.93,27.34 arc45 35.64,27.64 v36,28
D1  (via drill 0.3)
  Top 0.254: U1.45 v33.68,27.45 | v35.37,29.13 35.94,29.71 arc-45 36.65,30 44.75,30 arc90 45.75,31 R10.2 45.75,34.7 Q7.1
  Bottom 0.254: v33.68,27.45 v35.37,29.13
D2/SDA  (via drill 0.3)
  Top 0.254: U1.46 v34.01,28.49 | R36.1 55.75,56 arc90 56.25,55.5 J1.3 v58.5,55.5 59,55.5 arc90 59.25,55.75 59.25,64.25 arc90 59,64.5 J2.3
  Bottom 0.254: v34.01,28.49 54.01,48.49 arc4 54.35,48.85 | 54.35,48.85 57.21,51.71 arc45 57.5,52.41 57.5,55 arc-90 58,55.5 v58.5,55.5 | 54.35,48.85
D3/SCL  (via drill 0.3)
  Top 0.254: U1.47 v33.16,28.34 | J1.4 v58.5,56.5 | R37.1 J2.4 v58.75,65.5
  Bottom 0.254: v33.16,28.34 56.71,51.89 arc45 57,52.6 57,56 arc-90 J1.4 v58.5,56.5 arc90 58.75,56.75 v58.75,65.5
D4
  Top 0.254: U1.48 34.57,30.46 arc-45 35.27,30.75 39,30.75 arc90 40,31.75 R9.2 40,34.7 Q6.1
D5
  Top 0.254: Q5.1 34.25,34.7 R8.2 33.35,33.25 arc45 32.75,33 arc45 32.5,32.4 32.5,32.25 arc-45 32.15,31.4 29.68,28.93 arc45 29.5,28.5 arc45 29.58,28.31 U1.1
D6
  Top 0.254: Q4.1 28.5,34.7 28.5,33.5 R7.2 28.5,29.1 arc45 28.79,28.39 U1.2
D7
  Top 0.254: U1.3 25.27,31.21 arc45 24.56,31.5 23.25,31.5 arc-90 22.75,32 R6.2 22.75,34.7 Q3.1
D8
  Top 0.254: U1.4 25.06,30.71 arc45 24.35,31 18,31 arc-90 17,32 R5.2 17,34.7 Q2.1
D9
  Top 0.254: U1.5 24.85,30.21 arc45 24.15,30.5 12.25,30.5 arc-90 11.25,31.5 R4.2 11.25,34.7 Q1.1
D10
  Top 0.254: U1.6 24.65,29.71 arc45 23.94,30 7.9,30 arc-90 6.65,31.25 D2.4
D13~
  Top 0.254: U1.9 26.15,26.09 arc-45 26,26.44 26,26.79 arc45 25.85,27.15 TP5.TP
D14~/TX1
  Top 0.254: R38.1 17.9,86.1 arc45 17.54,86.25 13,86.25 arc90 12.5,85.75 arc-90 11.25,84.5 7.67,84.5 arc55 6,83.5 arc32 1.5,67.56 1.5,66.5 arc90 2.5,65.5 5,65.5 arc-90 6.5,64 6.5,60 arc-90 5,58.5 3.75,58.5 arc90 1.5,56.25 1.5,31.5 arc90 3.5,29.5 21.61,29.5 arc-45 22.32,29.21 U1.10
D15~/RX1
  Top 0.254: R39.1 17.9,86.9 arc-45 17.54,86.75 12.75,86.75 arc90 12,86 arc-90 11,85 7.64,85 arc55 5.57,83.76 arc32 1,67.56 1,66.5 arc90 2.5,65 5,65 arc-90 6,64 6,60 arc-90 5,59 3.75,59 arc90 1,56.25 1,31.5 arc90 3.5,29 21.4,29 arc-45 22.11,28.71 U1.11
D16~
  Top 0.254: U1.12 25.15,24.96 arc45 24.45,25.25 TP4.TP
D17~
  Top 0.254: U1.13 25.72,21.61 arc-45 25.46,21.5 arc-45 25.1,21.65 TP3.TP
D18~  (via drill 0.35)  (4 unrouted)
  Top 0.254: U1.16 26.77,20.54 arc45 26.62,20.19 v26.62,20.12
  Bottom 0.254: JP4.1@1 12.96,22.5 arc-45 13.67,22.21 18.08,17.79 arc45 18.79,17.5 24.21,17.5 arc45 24.92,17.79 26.48,19.35 arc45 26.62,19.71 v26.62,20.12
D20  (1 unrouted)
  Top 0.254: S1.2 3.75,2.35 arc90 4.25,2.85 C1.1 4.25,13 arc-90 4.75,13.5 20.23,13.5 arc45 21.79,14.15 U1.18
D21  (1 unrouted)
  Top 0.254: S2.2 15.25,2.35 arc90 15.75,2.85 C2.1 15.75,12.5 arc-90 16.25,13 20.44,13 arc45 22,13.65 U1.19
D22/A0  (1 unrouted)
  Top 0.254: S3.2 26.75,2.35 arc90 27.25,2.85 C3.1 27.25,17.77 arc-45 27.54,18.48 U1.20
D23/A1  (via drill 0.3)  (4 unrouted)
  Top 0.254: U1.21 v28.26,18.49
  Bottom 0.254: v28.26,18.49 27.06,17.29 arc-45 26.35,17 18.16,17 arc-45 17.46,17.29 15.04,19.71 arc45 14.34,20 JP3.1@1
D24/A2  (via drill 0.3)  (4 unrouted)
  Top 0.254: U1.22 v28.36,17.89
  Bottom 0.254: v28.36,17.89 27.27,16.79 arc-45 26.56,16.5 17.66,16.5 arc-45 16.96,16.79 16.54,17.21 arc45 15.84,17.5 JP2.1@1
D25/A3  (via drill 0.3)  (4 unrouted)
  Top 0.254: U1.23 v28.97,17.78
  Bottom 0.254: JP1.1@1 15.84,15 arc45 16.54,15.29 16.96,15.71 arc-45 17.66,16 26.77,16 arc45 27.48,16.29 v28.97,17.78
D26/A4
  Top 0.254: TP1.TP 29.5,17.4 arc-45 29.65,17.76 U1.24
D27/A5
  Top 0.254: U1.25 32.35,17.76 arc-45 32.5,17.4 TP2.TP
D30/A8  (via drill 0.3)  (1 unrouted)
  Top 0.254: U1.30 34.27,19.38 v34.62,19.38 | 53.6,17.59 S9.2 v53,17.59 C10.1
  Bottom 0.254: v34.62,19.38 39.67,19.38 arc-45 40.02,19.23 41.51,17.74 arc45 41.86,17.59 v53,17.59
D32/A10  (1 unrouted)
  Top 0.254: S4.2 38.25,2.35 arc90 38.75,2.85 C4.1 38.75,15.69 arc45 38.31,16.75 U1.32
D33/A11  (1 unrouted)
  Top 0.254: S5.2 49.75,2.35 arc90 50.25,2.85 C5.1 50.25,9.34 arc45 49.96,10.04 47.44,12.56 arc45 46.38,13 43.89,13 arc-45 41.98,13.79 U1.33
D34  (1 unrouted)
  Top 0.254: S6.2 61.25,2.35 arc90 61.75,2.85 C6.1 61.75,10.5 arc90 60.75,11.5 52.91,11.5 arc-45 52.21,11.79 49.29,14.71 arc45 48.59,15 42.1,15 arc-45 41.04,15.44 U1.34
D35  (1 unrouted)
  Top 0.254: S7.2 72.75,2.35 arc90 73.25,2.85 C7.1 73.25,12.5 arc90 72.25,13.5 51.81,13.5 arc-45 51.28,13.72 49.79,15.21 arc45 49.09,15.5 42.3,15.5 arc-45 41.24,15.94 U1.35
D36/A12  (1 unrouted)
  Top 0.254: U1.36 40.45,17.45 | 40.45,17.45 | S8.2 84.25,2.35 arc90 84.75,2.85 C8.1 84.75,13 arc90 83.75,14 52.31,14 arc-45 51.78,14.22 50.29,15.71 arc45 49.59,16 42.51,16 arc-45 41.45,16.44 40.45,17.45
D37/A13
  Top 0.254: U1.37 36.34,24.45 arc-90 37.05,24.45 43.5,18 R1.1
D38~/A14
  Top 0.254: U1.38 36.11,24.93 arc-90 37.32,24.93 37.83,24.42 42.46,19.79 arc45 43.16,19.5 R2.1
D39~/A15
  Top 0.254: U1.39 36.01,25.53 arc-90 37.47,25.53 41.71,21.29 arc45 42.41,21 R3.1
GND  (via drill 0.3)  (4 unrouted)
  Top 0.254: Q3.2 24.5,34.9 v24.5,36 | Q4.2 v30.2,36 | Q5.2 v35.95,36 | Q2.2 v18.7,36 | Q1.2 v12.95,36 | Q8.2 v53.2,36 | Q7.2 v47.45,36 | S1.4 v0.75,6.16 | v8.75,6.16 S1.3 | S2.4 v12.25,6.16 | S2.3 v20.25,6.16 | S3.4 v23.75,6.16 | S3.3 v31.75,6.16 | S4.4 v35.25,6.16 | S4.3 v43.25,6.16 | S5.4 v46.75,6.16 | S5.3 v54.75,6.16 | S6.4 v58.25,6.16 | S6.3 v66.25,6.16 | S7.4 v69.75,6.16 | S7.3 v77.75,6.16 | S8.4 v81.25,6.16 | S8.3 v89.25,6.16 | v6.5,8 C1.2 | v18,8 C2.2 | v29.5,8 C3.2 | v41,8 C4.2 | C5.2 v52.5,8 | v64,8 C6.2 | v75.5,8 C7.2 | v87,8 C8.2 | C11.2 v25.17,18.93 | U1.43 34.74,27.1 arc45 34.89,27.45 C12.2 v35.42,28.48 | U1.29 34.39,18.55 arc45 34.74,18.4 C9.2 v35.77,17.87 | C18.2 v37.75,90.5 | R43.1 v38.75,97.25 | R42.1 v37.25,97.25 | v20.75,96.25 20.75,95.95 C19.2 21.75,95.95 v21.75,96.25 | D11.C v34.75,86.25 | D2.3 v3.35,36.25 | D14.C v42,94.25 | C13.2 v3.5,44 | 25.74,19.46 C11.2 | C14.2 55.75,53.25 56,53.25 | 56,62.25 C15.2 | C14.2 v55.75,52.25 | C15.2 v55,62 | C11.2 25.7,19.96 arc-45 25.84,20.32 U1.15 | R4.1 v13.5,33.25 | R5.1 v19.25,33.25 | R6.1 v25,33.25 | R7.1 v30.75,33.25 | R8.1 v36.5,33.25 | R9.1 v42.25,33.25 | R10.1 v48,33.25 | R11.1 v53.75,33.25 | Q6.2 v42.5,34.9 | C14.2 56.5,53 arc90 57,53.5 J1.1 | C15.2 56.5,62 arc90 57,62.5 J2.1 | v55.25,21.41 S9.4 53.25,21.41 arc90 53,21.16 C10.2 | S9.3 v58.75,21.41 | v23.5,96.12 23.5,95.62 C20.2 22.75,95.62 v22.75,96.12
  Top 0.3: v28,89 U2.3 v30,89 | C16.2 v29.75,86.5
  Top 0.6: J4.GND2 v28.02,91.75 | J4.GND v34.48,91.75
  pour Bottom (isolate 0.254, rank 3): 0,0 0,100 90,100 90,0
N$1
  Top 0.254: U2.4 28.98,88.52 27.75,88.52 arc-90 27.25,89.02 C17.1
N$2
  Top 0.254: Q4.3 R19.1 D6.C
N$3
  Top 0.254: Q1.3 R13.1 D3.C
N$4
  Top 0.254: R14.1 R15.2 17.75,60.34 arc45 17.46,61.04 LS2.-
N$5
  Top 0.254: Q5.3 R21.1 D7.C
N$6
  Top 0.254: R22.1 R23.2 40.75,57.59 arc45 40.46,58.29 38.29,60.46 arc-45 38,61.16 38,74.59 arc45 37.71,75.29 LS8.-
N$7
  Top 0.254: Q8.3 R27.1 D10.C
N$8
  Top 0.254: R44.2 D14.A
N$9
  Top 0.254: Q3.3 R17.1 D5.C
N$10
  Top 0.254: R18.1 R19.2 29.25,50.34 arc45 28.96,51.04 arc-45 28.75,51.54 LS1.-
N$11
  Top 0.254: R12.1 R13.2 12,70.09 arc45 11.71,70.79 LS5.-
N$12
  Top 0.254: Q2.3 R15.1 D4.C
N$13
  Top 0.254: R20.1 R21.2 35,48.59 arc45 34.71,49.29 31.62,52.38 arc-45 31.5,52.66 31.5,63.09 arc45 31.21,63.79 LS4.-
N$14
  Top 0.254: Q6.3 R23.1 D8.C
N$15
  Top 0.254: R26.1 R27.2 52.25,68.34 arc45 51.96,69.04 LS6.-
N$16
  Top 0.254: R24.1 R25.2 46.5,56.09 arc45 46.21,56.79 LS3.-
N$17
  Top 0.254: Q7.3 R25.1 D9.C
N$18
  Top 0.254: R16.1 R17.2 23.5,75.59 arc45 23.21,76.29 LS7.-
N$19
  Top 0.254: U2.6 R40.1
N$20
  Top 0.254: R40.2 D11.A
N$21
  Top 0.254: R2.2 48.75,19.5 arc90 49.25,20 D1.4
N$22
  Top 0.254: D5.A R30.1
N$23
  Top 0.254: D7.A R32.1
N$24
  Top 0.254: D8.A R33.1
N$25
  Top 0.254: D6.A R31.1
N$26
  Top 0.254: D10.A R35.1
N$27
  Top 0.254: D3.A R28.1
N$28
  Top 0.254: D1.2 47.2,18 R1.2
N$29  (via drill 0.3)
  Top 0.254: R42.2 v37.25,94.25 | J4.B5 v29.5,91.75
  Bottom 0.254: v37.25,94.25 37.25,93.71 arc-45 37.1,93.35 34.9,91.15 arc-45 34.54,91 30.46,91 arc-45 30.1,91.15 v29.5,91.75
N$30  (via drill 0.3)
  Top 0.254: R43.2 v38.75,94.25 | J4.A5 v32.5,94.17
  Bottom 0.254: v32.5,94.17 33.6,95.28 arc-45 33.96,95.42 37.37,95.42 arc-45 37.72,95.28 v38.75,94.25
N$31
  Top 0.254: U2.1 30,90 arc90 30.5,90.5 J4.B6 30.5,93.93 arc-90 30.82,94.25 31.18,94.25 arc-90 31.5,93.93 J4.A6
N$32
  Top 0.254: U2.2 30,89.5 arc90 31,90.5 31,91.5 | 31,91.5 J4.A7 | J4.B7 32,91.82 arc-90 31.68,91.5 31,91.5
N$33
  Top 0.254: R29.1 D4.A
N$34
  Top 0.254: D9.A R34.1
N$35
  Top 0.254: R3.2 47.2,21 D1.1
RESETN  (via drill 0.3)
  Top 0.254: U1.40 v34.26,24.49 | C17.2 v25,90.25 24,90.25 | v27,44.25 25.79,45.46 arc-45 25.5,46.16 v25.5,75.5 | D12.A 24,90.25 | R41.1 24,90.25
  Bottom 0.254: v34.26,24.49 33.92,24.49 arc-45 33.22,24.78 31.79,26.21 arc-45 31.5,26.91 31.5,39.09 arc45 31.03,40.22 v27,44.25 | v25,90.25 25,76.41 arc45 25.29,75.71 v25.5,75.5
RXD
  Top 0.254: U2.9 37.75,89.5 arc-90 39,88.25 39,85.5 arc-90 38,84.5 27.5,84.5 arc-90 26.5,85.5 26.5,85.75 arc90 26,86.25 20.46,86.25 arc45 20.1,86.1 R38.2
TXD
  Top 0.254: U2.8 37.75,89 arc-90 38.5,88.25 38.5,85.5 arc-90 38,85 27.5,85 arc-90 27,85.5 27,85.75 arc90 26,86.75 20.46,86.75 arc-45 20.1,86.9 R39.2
UPDI  (via drill 0.3)
  Top 0.254: U1.41 v35.16,26.09
  Bottom 0.254: DEBUG.3 81.85,29.2 arc45 81.7,29.55 77.48,33.77 arc90 77.27,33.77 71.65,28.15 arc-45 71.3,28 37.27,28 arc45 36.91,27.85 v35.16,26.09
V3
  Top 0.254: U2.10 34.25,90 arc90 34.5,90.25 arc-90 34.75,90.5 C18.1
VBUS  (via drill 0.3)
  Top 0.45: J4.VBUS2 28.8,93.8 29.75,94.75 | 29.75,94.75 32.75,94.75 33.7,93.8 J4.VBUS1 | 29.75,94.75 28.11,96.39 D13.A v25,97.25
  Bottom 0.45: v25,97.25 arc45 23.79,97.75 22.5,97.75 arc11 21,97.38 arc8 19.25,96.62 arc4 14.5,94 arc14 12.25,92.25 arc45 11.4,90.19 J3.2

### Text on the board
tPlace: + | - | Use Serial1 / for UART | For starting, try: / D20 = First Button / D10 = WS2812B / D9 = Buzzer | 2x | Piezo Piano | V1.4 | Needed space for mounting
tNames: +5V / max! | RGB LED / WS2812B | +5V | Microcontroller / ATmega4809 | GND | RGB LED | FN-KEY | Reference Sizes | D18~ | Prototype / Area | SOT-23 | A1 | 4mm | A2 | 0805 | BGA80 | 0603 | A3 | Hole | ZΔ⅗ 2023
bNames: Lorem ipsum dolor sit amet, consectetur adipiscing elit. Donec non est pellentesque, / maximus urna a, tincidunt lorem. Sed ultrices dui nulla, venenatis placerat sem iaculis / et. Nunc sit amet malesuada dolor, vel porta velit. In hac habitasse platea dictumst. / Duis vulputate lorem ipsum, eu tincidunt risus placerat eget. Phasellus condimentum / ipsum quis nunc hendrerit, sit amet tempor risus vehicula. Donec placerat efficitur nisi, / id efficitur lorem eleifend et. Aenean risus turpis, iaculis quis pharetra a, maximus at erat. / Sed porta ipsum quis magna consequat semper. Maecenas quis porta nibh, id fermentum / arcu. Vestibulum vel lacus at eros pharetra dictum. Integer non lectus odio. Nullam a / lacus porttitor, molestie tortor ornare, auctor dolor. Ut consectetur nibh arcu, in ultrices / diam elementum ac. Nulla mauris leo, malesuada quis pharetra eget, ornare vel velit. / Fusce tempor malesuada sapien vel tempus. Nunc eu velit ut leo dictum tempus ac / aliquam ipsum. Integer eget justo sit amet massa posuere convallis et eget massa. / Aenean ac consectetur mi. Cras est enim, feugiat sagittis ante eu, aliquam vehicula / tellus. Cras ullamcorper augue sodales mattis volutpat. Nam quis sagittis lectus, eu / aliquam quam. Cras odio turpis, consectetur id placerat eget, cursus nec nunc. Cras / sodales ornare nisi quis gravida. Ut non nisl sit amet arcu cursus commodo eget et. / a tellus. Donec dapibus sed augue eu aliquam. Integer ligula nulla, pellentesque / consequat eu, imperdiet at dolor. Etiam fringilla urna tortor. Donec pharetra ex / vehicula, et rhoncus neque mattis. Vivamus leo risus, congue ut accumsan et, in al. / erat. Pellentesque vitae risus sit amet urna tempus ultrices. Maecenas molestie erat / tortor, ac sagittis nisi dapibus eu. Lorem ipsum dolor sit amet, consectetur adipiscing elit. / Donec non hendrerit ex. Duis et vestibulum augue. Aenean eget arcu rutrum tortor / euismod porta quis at magna. Suspendisse potenti. Integer nunc magna, mattis vitae / suscipit sed, ultricies id sem. In posuere nisl iaculis massa efficitur, eget eleifend massa / sollicitudin. Donec enim massa, sagittis sed efficitur vel, sollicitudin et tellus. Mauris sed / ante in dui porttitor consequat. In hac habitasse platea dictumst. Donec auctor nibh / vel elit tristique hendrerit. Pellentesque et faucibus quam. Vivamus at turpis laoreet, / ornare magna eget, malesuada nunc. Fusce malesuada massa felis, cursus finibus dui / viverra ut. Duis commodo finibus commodo. Morbi sodales vulputate mauris, eget / molestie ex gravida quis. Phasellus tempus velit eu orci lacinia imperdiet. Proin eget / ipsum non lectus mattis mollis vitae arcu. Curabitur semper tempus dignissim. Nunc / efficitur magna vel nisi maximus, rhoncus laoreet leo vestibulum. Proin maximus convallis / est ut eleifend. Etiam sollicitudin sem id congue rutrum. Integer suscipit, ante in / consequat condimentum, est erat tempus purus, sed fringilla tortor augue sed justo. / Ut non nisl sit amet arcu cursus commodo eget et metus.
tDocu: INFO: / - Renumber from bottom left to top right